# Altium project SPICEBot.PrjPcb
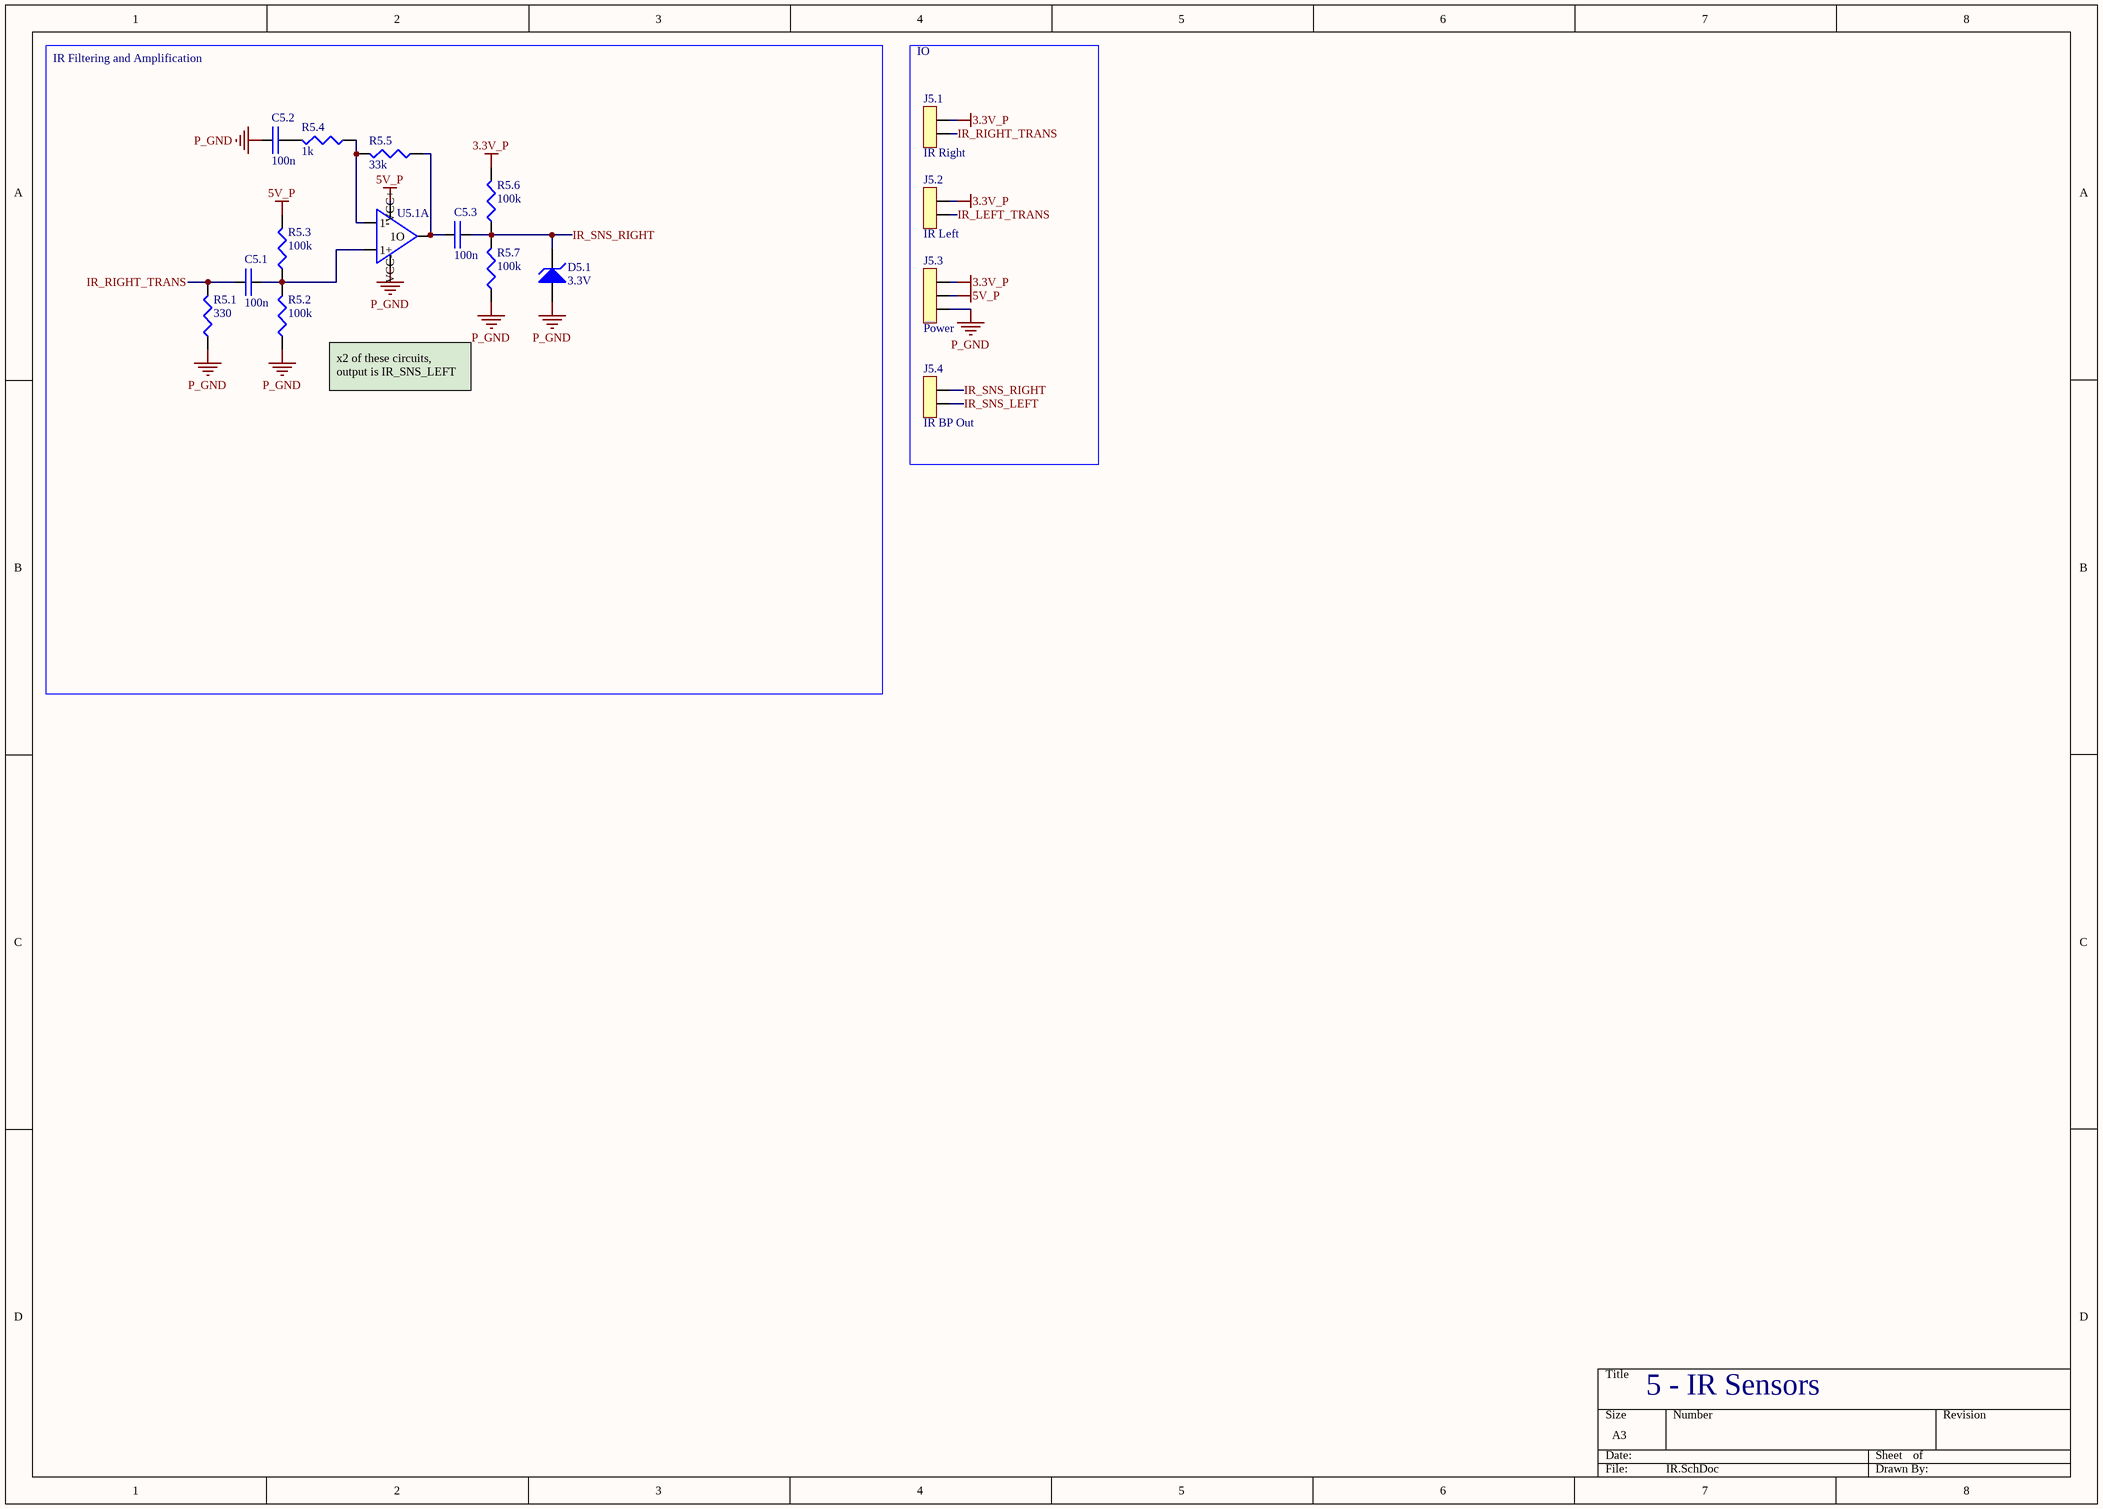
[diagram p0: IR.SchDoc]
1 sheet, 16 parts. Net scope: global (net labels, ports and power ports of the same name join across sheets).
Board files: BP.PcbDoc, IR Sensors.PcbDoc, Reflectance.PcbDoc, Rear Motors.PcbDoc, Servos.PcbDoc, Reflectance (Single).PcbDoc, Gate Driver Chip.PcbDoc, Motor Driver (Single).PcbDoc

## Sheet IR.SchDoc
size A3; SheetNumber: 2; SheetTotal: 8

### Parts
C5.1  100n  [Non Polarized Cap]
C5.2  100n  [Non Polarized Cap]
C5.3  100n  [Non Polarized Cap]
D5.1  3.3V  [Zener Generic]
J5.1  IR Right  [2pos JST]
J5.2  IR Left  [2pos JST]
J5.3  Power  [3pos JST]
J5.4  IR BP Out  [2pos JST]
R5.1  330  [Res_Generic]
R5.2  100k  [Res_Generic]
R5.3  100k  [Res_Generic]
R5.4  1k  [Res_Generic]
R5.5  33k  [Res_Generic]
R5.6  100k  [Res_Generic]
R5.7  100k  [Res_Generic]
U5.1  TL082IP  [DIP8]  (value not drawn)  (part A of 2)

### Blocks framed on the sheet
IR Filtering and Amplification: C5.1-C5.3 D5.1 R5.1-R5.7 U5.1
IO: J5.1-J5.4

### Nets
3.3V_P: J5.1.2 J5.2.2 J5.3.3 R5.6.2
5V_P: J5.3.2 R5.3.2 U5.1.8(VCC+)
P_GND: C5.2.1 D5.1.1(Anode) J5.3.1 R5.1.1 R5.2.1 R5.7.1 U5.1.4(VCC-)
IR_LEFT_TRANS: J5.2.1
IR_RIGHT_TRANS: C5.1.1 J5.1.1 R5.1.2
IR_SNS_LEFT: J5.4.1
IR_SNS_RIGHT: C5.3.2 D5.1.2(Cathode) J5.4.2 R5.6.1 R5.7.2
NetC5.1_2: C5.1.2 R5.2.2 R5.3.1 U5.1.3(1+)
NetC5.2_2: C5.2.2 R5.4.2
NetC5.3_1: C5.3.1 R5.5.1 U5.1.1(1O)
NetR5.4_1: R5.4.1 R5.5.2 U5.1.2(1-)

### Notes on the sheet
- x2 of these circuits, output is IR_SNS_LEFT
- 5 - IR Sensors

### Library data of the parts
C5.1-C5.3 = Cap_Generic
D5.1 = Zener_Generic
J5.1 J5.2 J5.4 = 2pos Conn: 2pos Conn JST
J5.3 = 3pos Conn
R5.1-R5.7 = Res_Generic
U5.1 = TL082IP Op Amp: TL082IP IC OPAMP JFET 2 CIRCUIT 8DIP; Supplier 1: Mouser; Supplier Part Number 1: 595-TL082IP